# EAGLE design GEP Analog Board V100 (EAGLE 9.5.1)
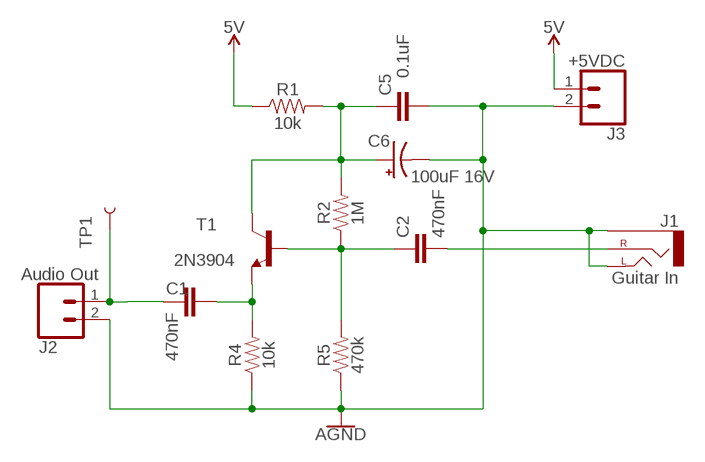
[diagram p0: schematic, sheet 1]

## Parts
C1  470nF  0.1UF-KIT-EZ-50V-20%  [CAP-PTH-SMALL-KIT]
C2  470nF  0.1UF-KIT-EZ-50V-20%  [CAP-PTH-SMALL-KIT]
C5  0.1uF  0.1UF-KIT-EZ-50V-20%  [CAP-PTH-SMALL-KIT]
C6  100uF 16V  100UF-POLAR-RADIAL-2.5MM-25V-20%  [CPOL-RADIAL-2.5MM-6.5MM]
J1  Guitar In  AUDIO_JACK_2.5MMSPECIAL_POGO_PINS  [STEREOJACK2.5MM_SPECIAL_POGOPINS]
J2  Audio Out  CONN_02  [1X02]
J3  +5VDC  CONN_02  [1X02]
R1  10k  100KOHM-HORIZ-1/4W-1%  [AXIAL-0.3]
R2  1M  100KOHM-HORIZ-1/4W-1%  [AXIAL-0.3]
R4  10k  100KOHM-HORIZ-1/4W-1%  [AXIAL-0.3]
R5  470k  100KOHM-HORIZ-1/4W-1%  [AXIAL-0.3]
T1  2N3904  [TO92]
TP1  TEST-POINTTP_15TH_THRU  [TP_15TH]

## Nets
5V: J3.1 R1.P$1
AGND: C5.2 C6.2(-) J1.RING1(SLEEVE) J1.SHIELD(LEFT) J2.2 J3.2 R4.P$1 R5.P$1
N$1: C2.1 R2.P$1 R5.P$2 T1.2(B)
N$2: C2.2 J1.TIP(RIGHT)
N$3: C1.2 J2.1 TP1.P$1
N$5: C1.1 R4.P$2 T1.3(E)
N$6: C5.1 C6.1(+) R1.P$2 R2.P$2 T1.1(C)

## Library data of the parts
C1 C2 = SparkFun-Capacitors:0.1UF: 0.1µF ceramic capacitors A capacitor is a passive two-terminal electrical component used to store electrical energy temporarily in an electric field.; PROD_ID: CAP-08370; VALUE: 0.1uF
C5 = SparkFun-Capacitors:0.1UF: 0.1µF ceramic capacitors A capacitor is a passive two-terminal electrical component used to store electrical energy temporarily in an electric field.; PROD_ID: CAP-08370
C6 = SparkFun-Capacitors:100UF-POLAR: 100µF polarized capacitors A capacitor is a passive two-terminal electrical component used to store electrical energy temporarily in an electric field.; PROD_ID: CAP-08439; VALUE: 100uF
J1 = SparkFun-Connectors:AUDIO_JACK_2.5MM: Audio Jack 2.5mm variants of PTH and SMT audio jacks. SparkFun Products: SparkFun PicoBoard <https://www.sparkfun.com/products/11888>- 2.5mm SMD
J2 J3 = SparkFun-Connectors:CONN_02: Multi connection point. Often used as Generic Header-pin footprint for 0.1 inch spaced/style header connections On any of the 0.1 inch spaced packages, you can populate with these: Break Away Headers - Straight <https://www.sparkfun.com/products/116> (PRT-00116) Break Away Male Headers - Right Angle <https://www.sparkfun.com/products/553> (PRT-00553) Female Headers <https://www.sparkfun.com/products/115> (PRT-00115) Break Away Headers - Machine Pin <https://www.sparkfun.com/products/117> (PRT-00117) Break Away Female Headers - Swiss Machine Pin <https://www.sparkfun.com/products/743> (PRT-00743) For SCREWTERMINALS and SPRING TERMINALS visit here: Screw Terimnals on SparkFun.com <https://www.sparkfun.com/search/results?term=Screw+Terminals> (5mm/3.5mm/2.54mm spacing) This device is also useful as a general connection point to wire up your design to another part of your project. Our various solder wires solder well into these plated through hole pads. Hook-Up Wire - Assortment (Stranded, 22 AWG) <https://www.sparkfun.com/products/11375> (PRT-11375) Hook-Up Wire - Assortment (Solid Core, 22 AWG) <https://www.sparkfun.com/products/11367> (PRT-11367) View the entire wire category on our website here <https://www.sparkfun.com/categories/141> Special notes: Molex polarized connector foot print use with: PRT-08233 with associated crimp pins and housings. 2.54_SCREWTERM for use with PRT-10571. 3.5mm Screw Terminal footprints for PRT-08084 5mm Screw Terminal footprints for use with PRT-08432
R1 R2 R4 R5 = SparkFun-Resistors:100KOHM: 100kΩ resistor A resistor is a passive two-terminal electrical component that implements electrical resistance as a circuit element. Resistors act to reduce current flow, and, at the same time, act to lower voltage levels within circuits. - Wikipedia; PROD_ID: RES-12184; VALUE: 100k
T1 = transistor-neu-to92:2N3904: NPN TRANSISTOR
TP1 = SparkFun-Connectors:TEST-POINT: SparkFun Test Points Bare copper test points for troubleshooting or In-Circuit-Testing. These are used by our Production team for verifying production board runs using pogo-pins on test beds. SparkFun Products: SparkFun LSM9DS1 Breakout <https://www.sparkfun.com/products/13284> SparkFun PSOC <https://www.sparkfun.com/products/13714> SparkFun Load Cell Amplifier <https://www.sparkfun.com/products/13879>

## Net classes
0 default: width 0.051 mm, drill 0.051 mm, clearance 0.102 mm
1 Heavy: width 0.102 mm, drill 0.051 mm, clearance 0.102 mm

## Board
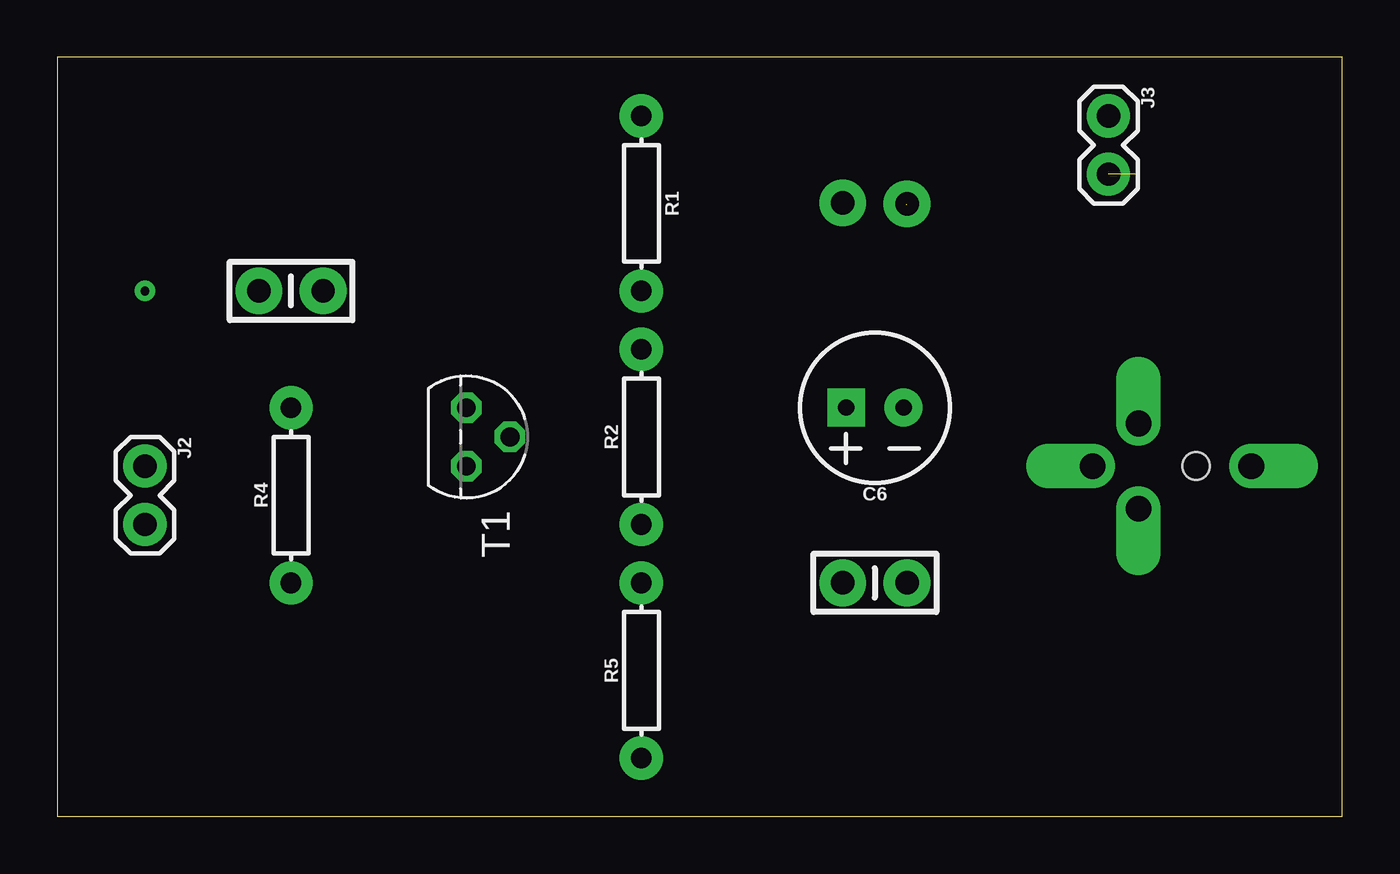
[diagram p1: board, top side]
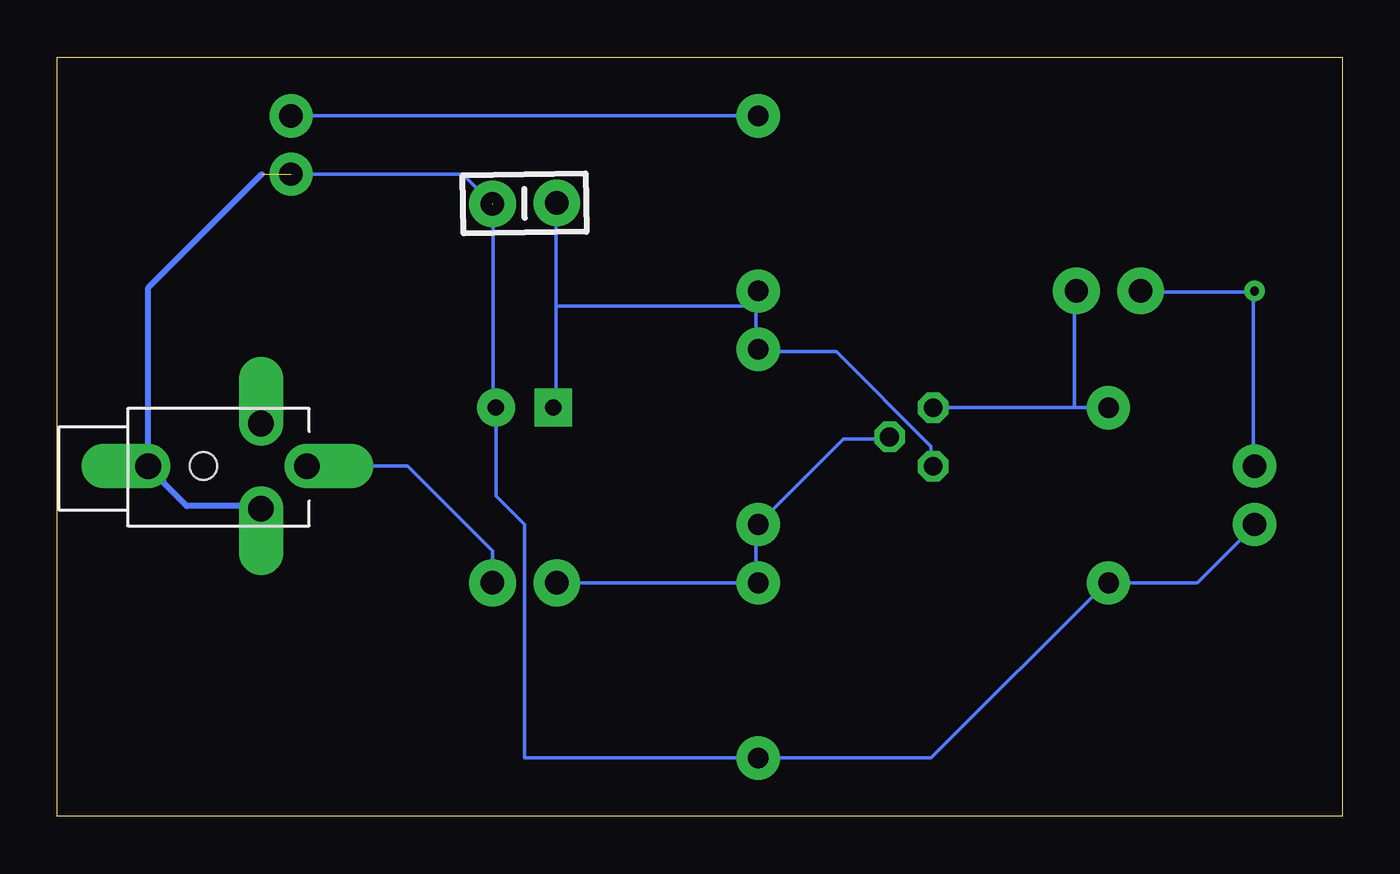
[diagram p2: board, bottom side, seen from below]

Size 55.88 x 33.02 mm. Coordinates in mm from the lower left corner, seen from the top.
Outline: 0,0 55.88,0 55.88,33.02 0,33.02 0,0
Copper layers (1*16): Top 0.035mm / dielectric 1.5mm / Bottom 0.035mm
Design rules "default": minimum track width 6mil, minimum drill 0.35mm, track to track 6mil, track to pad 6mil, pad to pad 6mil, via to via 6mil, smd to smd 6mil, copper to edge 40mil, drill to drill 6mil, minimum pad ring 10mil, minimum via ring 8mil, stop-mask expansion 4mil, vias tented up to drill 0mil, thermal gap 10mil

### Footprints (pad centres in the part's own frame; a part is rotated, then mirrored left to right if it is on the bottom)
CAP-PTH-SMALL-KIT = drill 1.016 pad 2.032: 1 -1.397,0; 2 1.397,0
CPOL-RADIAL-2.5MM-6.5MM = drill 0.7 pad 1.651 square: 1 1.25,0 | drill 0.7 pad 1.651: 2 -1.25,0
STEREOJACK2.5MM_SPECIAL_POGOPINS = drill 1.118 pad 1.93 offset: RING1 2.5,-1.85; RING2 2.5,1.85; SHIELD -2.4,0; TIP 4.5,0 | hole 1.2: 0,0
1X02 = drill 1.016 pad 1.88: 1 0,0; 2 2.54,0
AXIAL-0.3 = drill 0.9 pad 1.88: P$1 -3.81,0; P$2 3.81,0
TO92 = drill 0.813 octagon: 1 1.27,0; 2 0,1.905; 3 -1.27,0
TP_15TH = drill 0.381 pad 0.61: P$1 0,0

### Placement (x,y rotation side)
C1  10.16,22.86 180 top
C2  35.56,10.16 0 top
C5  35.56,26.67 180.9 bottom
C6  35.56,17.78 180 top
J1  49.53,15.24 0 bottom
J2  3.81,15.24 270 top
J3  45.72,30.48 270 top
R1  25.4,26.67 270 top
R2  25.4,16.51 90 top
R4  10.16,13.97 90 top
R5  25.4,6.35 90 top
T1  17.78,16.51 270 top
TP1  3.81,22.86 0 top

### Tracks (layer width: path | path; a pad name or v marks a point on that pad's centre or on a via)
5V
  Bottom 0.152: R1.P$1 J3.1
AGND  (2 unrouted)
  Bottom 0.152: 36.93,26.62 36.93,17.78 C6.2 | 36.78,17.78 C6.2 | J2.2 3.86,12.6 6.3,10.16 R4.P$1 10.26,10.16 17.88,2.54 R5.P$1 35.56,2.54 35.56,12.7 36.81,13.95 C6.2 | C5.2 38.25,27.94 J3.2
  Bottom 0.254: J1.RING1 47.14,13.5 50.25,13.5 51.27,14.52 51.27,14.58 J1.SHIELD 51.93,23 46.99,27.94
N$1
  Bottom 0.152: T1.2 19.71,16.41 21.69,16.41 R2.P$1 25.5,12.6 25.5,10.16 | 25.5,10.16 C2.1 | 25.5,10.16 R5.P$2
N$2
  Bottom 0.152: 37.39,10.16 C2.2 36.96,11.56 40.64,15.24 J1.TIP
N$3
  Bottom 0.152: 3.86,22.81 8.74,22.81 C1.2 | 3.86,22.81 3.86,15.34 J2.1 | 3.86,22.81 TP1.P$1
N$5
  Bottom 0.152: R4.P$2 11.63,17.78 | 11.63,17.78 T1.3 | 11.63,17.78 11.63,22.81 C1.1
N$6
  Bottom 0.152: 34.19,22.2 34.19,26.62 C5.1 | 34.19,22.2 34.19,17.78 C6.1 | T1.1 17.88,15.34 17.88,16.1 22,20.22 25.35,20.22 R2.P$2 25.5,20.37 25.5,22.2 | 25.5,22.2 25.5,22.81 R1.P$2 25.5,22.2 | 25.5,22.2 34.19,22.2